# EAGLE schematic dw1000_schematic (EAGLE 9.6.2)
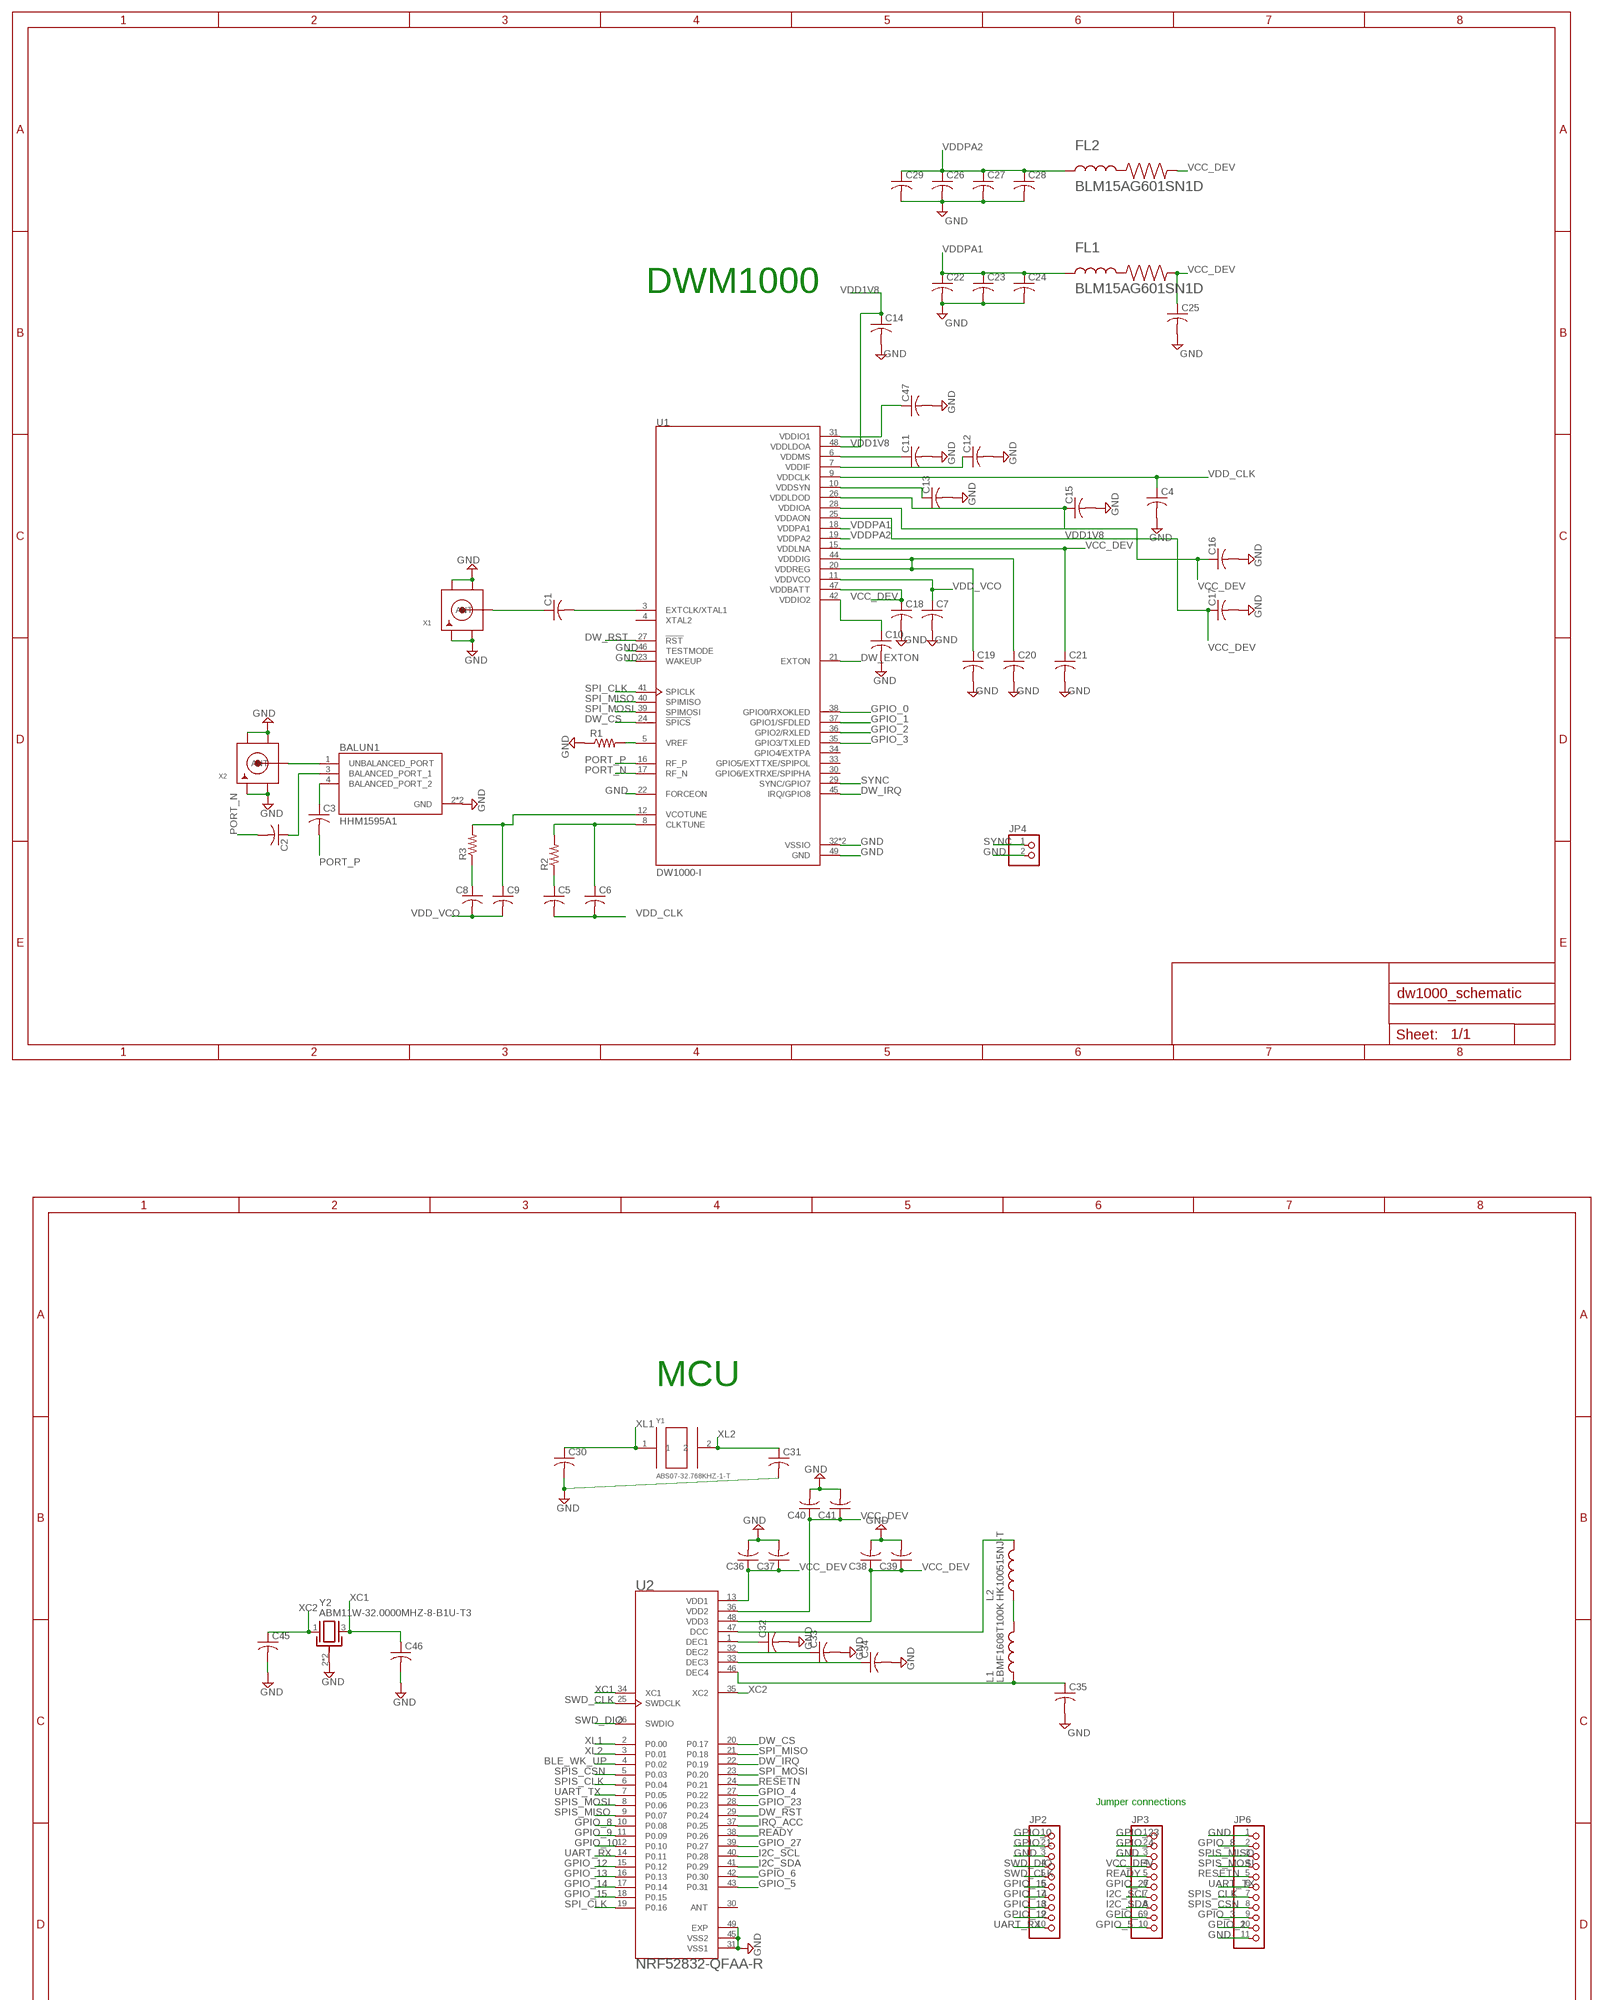
[diagram p0: schematic, sheet 1, part 1 of 2]
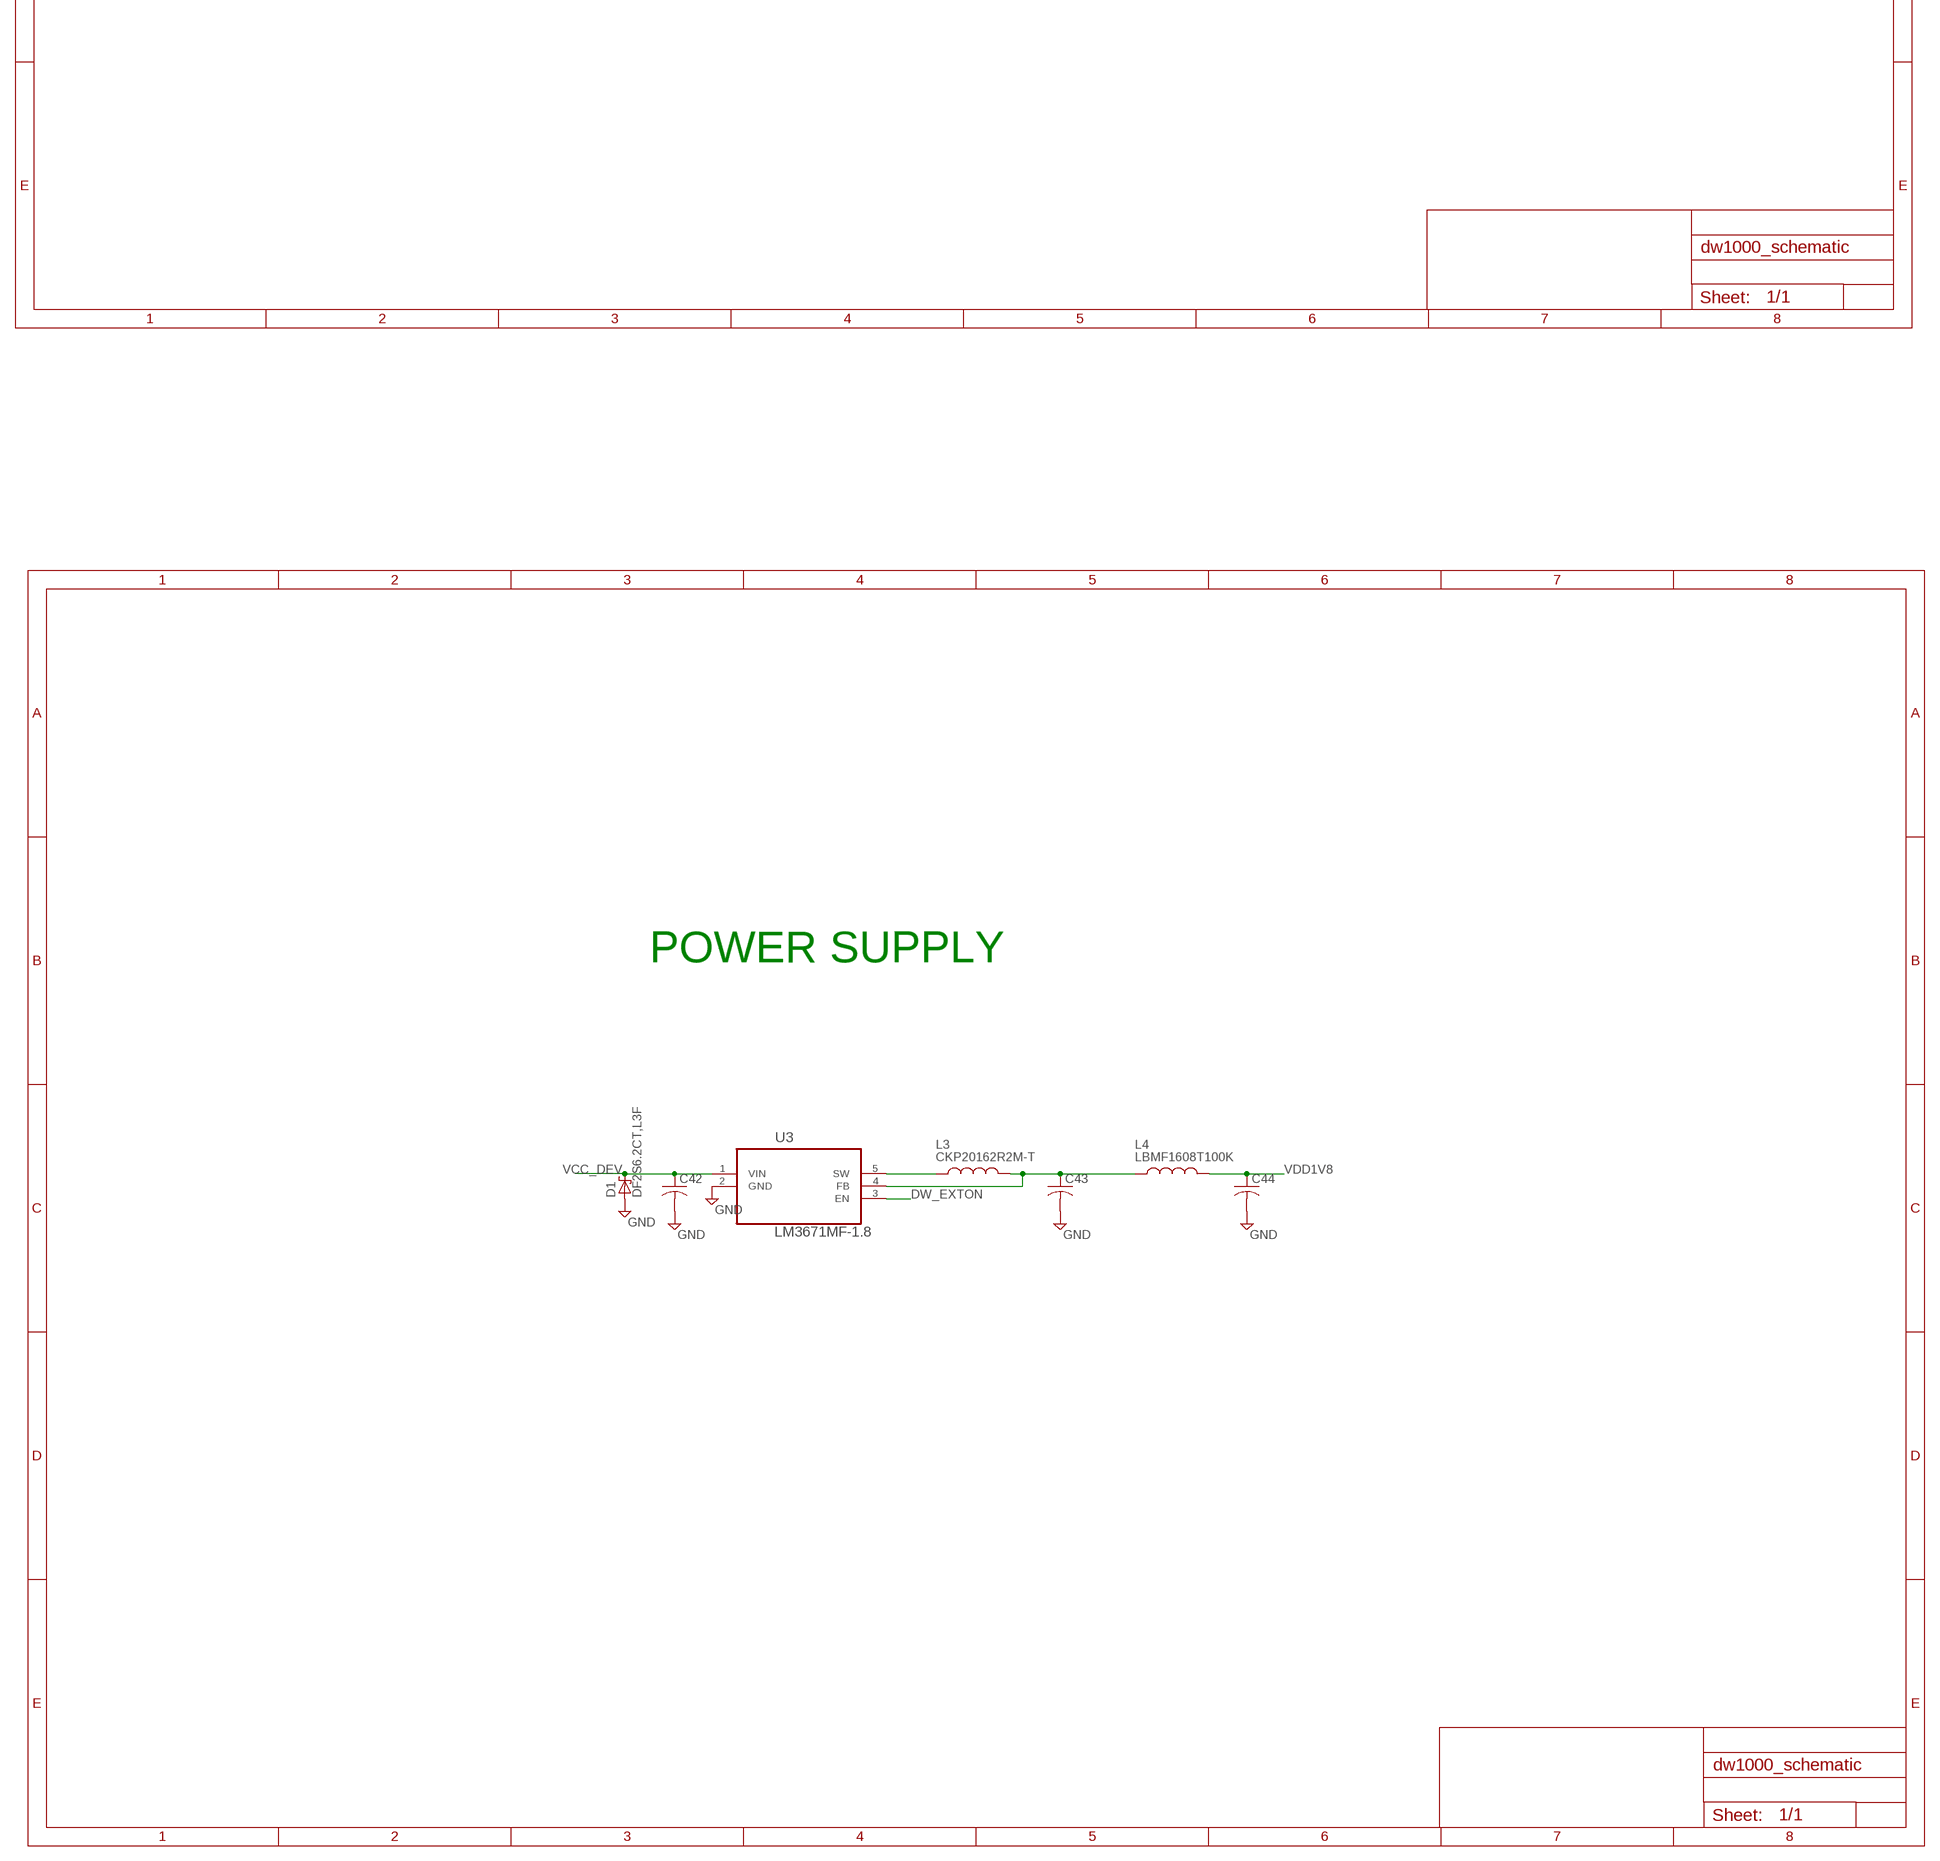
[diagram p1: schematic, sheet 1, part 2 of 2]

## Parts
BALUN1  HHM1595A1  [BALUN_HHM1595A1]
C1  C-USC0603K  [C0603K]
C2  C-USC0402K  [C0402K]
C3  C-USC0402K  [C0402K]
C4  C-USC0402K  [C0402K]
C5  C-USC0402K  [C0402K]
C6  C-USC0402K  [C0402K]
C7  C-USC0402K  [C0402K]
C8  C-USC0402K  [C0402K]
C9  C-USC0402K  [C0402K]
C10  C-USC0402K  [C0402K]
C11  C-USC0402K  [C0402K]
C12  C-USC0402K  [C0402K]
C13  C-USC0402K  [C0402K]
C14  C-USC0402K  [C0402K]
C15  C-USC0402K  [C0402K]
C16  C-USC0402K  [C0402K]
C17  C-USC0402K  [C0402K]
C18  C-USC0402K  [C0402K]
C19  C-USC0402K  [C0402K]
C20  C-USC0402K  [C0402K]
C21  C-USC0402K  [C0402K]
C22  C-USC0402K  [C0402K]
C23  C-USC0402K  [C0402K]
C24  C-USC0402K  [C0402K]
C25  C-USC0603K  [C0603K]
C26  C-USC0402K  [C0402K]
C27  C-USC0402K  [C0402K]
C28  C-USC0402K  [C0402K]
C29  C-USC0805K  [C0805K]
C30  C-USC0402K  [C0402K]
C31  C-USC0402K  [C0402K]
C32  C-USC0402K  [C0402K]
C33  C-USC0402K  [C0402K]
C34  C-USC0402K  [C0402K]
C35  C-USC0603K  [C0603K]
C36  C-USC0402K  [C0402K]
C37  C-USC0402K  [C0402K]
C38  C-USC0603K  [C0603K]
C39  C-USC0402K  [C0402K]
C40  C-USC0402K  [C0402K]
C41  C-USC0402K  [C0402K]
C42  C-USC0603K  [C0603K]
C43  C-USC0603K  [C0603K]
C44  C-USC0603K  [C0603K]
C45  C-USC0402K  [C0402K]
C46  C-USC0402K  [C0402K]
C47  C-USC0402K  [C0402K]
D1  DF2S6.2CT,L3F  [DF2S6.2CT,L3F]
FL1  BLM15AG601SN1D  [BEADC1005X55N]
FL2  BLM15AG601SN1D  [BEADC1005X55N]
JP2  PINHD-1X10  [1X10]
JP3  PINHD-1X10  [1X10]
JP4  PINHD-1X2  [1X02]
JP6  PINHD-1X11  [1X11]
L1  LBMF1608T100K  [INDC1608X100N]
L2  HK100515NJ-T  [INDC1005X55N]
L3  CKP20162R2M-T  [INDC2016X100N]
L4  LBMF1608T100K  [INDC1608X100N]
R1  R-US_R0402  [R0402]
R2  R-US_R0402  [R0402]
R3  R-US_R0402  [R0402]
U1  DW1000-I  [QFN40P600X600X90-49N]
U2  NRF52832-QFAA-R  [QFN40P600X600X90-49N]
U3  LM3671MF-1.8  [SOT95P284X122-5N]
X1  SMACONNECTOR_EDGE  [SMA_EDGELAUNCH]
X2  SMACONNECTOR_EDGE  [SMA_EDGELAUNCH]
Y1  ABS07-32.768KHZ-1-T  [XTAL320X150X90]
Y2  ABM11W-32.0000MHZ-8-B1U-T3  [XTAL_ABM11W-32.0000MHZ-8-B1U-T3]

## Nets
BLE_WK_UP: U2.4(P0.02)
DW_CS: U1.24(!SPICS) U2.20(P0.17)
DW_EXTON: U1.21(EXTON) U3.3(EN)
DW_IRQ: U1.45(IRQ/GPIO8) U2.22(P0.19)
DW_RST: U1.27(!RST) U2.29(P0.24)
GND: BALUN1.2(GND) BALUN1.5(GND) C4.2 C7.2 C10.2 C11.2 C12.2 C13.2 C14.2 C15.2 C16.2 C17.2 C18.2 C19.2 C20.2 C21.2 C22.2 C23.2 C24.2 C25.2 C26.2 C27.2 C28.2 C29.2 C30.2 C31.2 C32.2 C33.2 C34.2 C35.2 C36.2 C37.2 C38.2 C39.2 C40.2 C41.2 C42.2 C43.2 C44.2 C45.2 C46.2 C47.2 D1.1 JP2.3 JP3.3 JP4.2 JP6.1 JP6.11 R1.1 U1.22(FORCEON) U1.23(WAKEUP) U1.32(VSSIO) U1.43(VSSIO) U1.46(TESTMODE) U1.49(GND) U2.31(VSS1) U2.45(VSS2) U2.49(EXP) U3.2(GND) X1.GND@1(GND4) X1.GND@2(GND3) X1.GND@3(GND2) X1.GND@4(GND1) X2.GND@1(GND4) X2.GND@2(GND3) X2.GND@3(GND2) X2.GND@4(GND1) Y2.2(GND) Y2.4(GND)
GPIO_0: JP2.1 U1.38(GPIO0/RXOKLED)
GPIO_1: JP2.2 U1.37(GPIO1/SFDLED)
GPIO_2: JP6.10 U1.36(GPIO2/RXLED)
GPIO_3: JP6.9 U1.35(GPIO3/TXLED)
GPIO_4: JP3.2 U2.27(P0.22)
GPIO_5: JP3.10 U2.43(P0.31)
GPIO_6: JP3.9 U2.42(P0.30)
GPIO_8: JP6.2 U2.10(P0.08)
GPIO_9: U2.11(P0.09)
GPIO_10: U2.12(P0.10)
GPIO_12: JP2.9 U2.15(P0.12)
GPIO_13: JP2.8 U2.16(P0.13)
GPIO_14: JP2.7 U2.17(P0.14)
GPIO_15: JP2.6 U2.18(P0.15)
GPIO_23: JP3.1 U2.28(P0.23)
GPIO_27: JP3.6 U2.39(P0.27)
I2C_SCL: JP3.7 U2.40(P0.28)
I2C_SDA: JP3.8 U2.41(P0.29)
IRQ_ACC: U2.37(P0.25)
N$1: R1.2 U1.5(VREF)
N$2: BALUN1.1(UNBALANCED_PORT) X2.P(ANT)
N$3: C1.1 X1.P(ANT)
N$4: C1.2 U1.3(EXTCLK/XTAL1)
N$5: BALUN1.3(BALANCED_PORT_1) C2.1
N$6: BALUN1.4(BALANCED_PORT_2) C3.1
N$7: C5.1 R2.1
N$8: C6.1 R2.2 U1.8(CLKTUNE)
N$9: C9.1 R3.2 U1.12(VCOTUNE)
N$10: C47.1 U1.31(VDDIO1)
N$11: C8.1 R3.1
N$12: C11.1 U1.6(VDDMS)
N$13: C12.1 U1.7(VDDIF)
N$14: C13.1 U1.10(VDDSYN)
N$15: C19.1 C20.1 U1.20(VDDREG) U1.44(VDDDIG)
N$16: C10.1 U1.42(VDDIO2)
N$17: C32.1 U2.1(DEC1)
N$18: C33.1 U2.32(DEC2)
N$19: C34.1 U2.33(DEC3)
N$20: C35.1 L1.1 U2.46(DEC4)
N$21: L1.2 L2.1
N$22: L2.2 U2.47(DCC)
N$23: L3.1 U3.5(SW)
N$24: C43.1 L3.2 L4.1 U3.4(FB)
PORT_N [diff_pairs]: C2.2 U1.17(RF_N)
PORT_P [diff_pairs]: C3.2 U1.16(RF_P)
READY: JP3.5 U2.38(P0.26)
RESETN: JP6.5 U2.24(P0.21)
SPI_CLK: U1.41(SPICLK) U2.19(P0.16)
SPI_MISO: U1.40(SPIMISO) U2.21(P0.18)
SPI_MOSI: U1.39(SPIMOSI) U2.23(P0.20)
SPIS_CLK: JP6.7 U2.6(P0.04)
SPIS_CSN: JP6.8 U2.5(P0.03)
SPIS_MISO: JP6.3 U2.9(P0.07)
SPIS_MOSI: JP6.4 U2.8(P0.06)
SWD_CLK: JP2.5 U2.25(SWDCLK)
SWD_DIO: JP2.4 U2.26(SWDIO)
SYNC: JP4.1 U1.29(SYNC/GPIO7)
UART_RX: JP2.10 U2.14(P0.11)
UART_TX: JP6.6 U2.7(P0.05)
VCC_DEV: C16.1 C17.1 C18.1 C21.1 C25.1 C36.1 C37.1 C38.1 C39.1 C40.1 C41.1 C42.1 D1.2 FL1.2 FL2.2 JP3.4 U1.15(VDDLNA) U1.25(VDDAON) U1.28(VDDIOA) U1.47(VDDBATT) U2.13(VDD1) U2.36(VDD2) U2.48(VDD3) U3.1(VIN)
VDD1V8: C14.1 C15.1 C44.1 L4.2 U1.26(VDDLDOD) U1.48(VDDLDOA)
VDD_CLK: C4.1 C5.2 C6.2 U1.9(VDDCLK)
VDD_VCO: C7.1 C8.2 C9.2 U1.11(VDDVCO)
VDDPA1: C22.1 C23.1 C24.1 FL1.1 U1.18(VDDPA1)
VDDPA2: C26.1 C27.1 C28.1 C29.1 FL2.1 U1.19(VDDPA2)
XC1: C46.1 U2.34(XC1) Y2.3
XC2: C45.1 U2.35(XC2) Y2.1
XL1: C30.1 U2.2(P0.00) Y1.1
XL2: C31.1 U2.3(P0.01) Y1.2
Unconnected: U1.4(XTAL2) U1.30(GPIO6/EXTRXE/SPIPHA) U1.33(GPIO5/EXTTXE/SPIPOL) U1.34(GPIO4/EXTPA) U2.30(ANT)

## Notes on the sheet
- DWM1000
- MCU
- Jumper connections
- POWER SUPPLY

## Library data of the parts
BALUN1 = HHM1595A1:HHM1595A1: Baluns 50/100ohm, 3-8GHz Ultrawideband Balun; AVAILABILITY: Unavailable; DESCRIPTION: RF Balun 3GHz ~ 8GHz 50 / 100Ohm 0805 _2012 Metric_; DIGIKEY-PURCHASE-URL: https://snapeda.com/shop?store=DigiKey&id=490384; MF: TDK; MP: HHM1595A1; PACKAGE: 0805 TDK; PRICE: None
C1-C28 C30-C47 = adafruit:C-US: CAPACITOR, American symbol
C29 = rcl:C-US: CAPACITOR, American symbol; SPICEPREFIX: C
D1 = DF2S6.2CT:DF2S6.2CT,L3F
FL1 FL2 = BLM15AG601SN1D:BLM15AG601SN1D: Ferrite: bead; 600Ω; Mounting: SMD; 300mA; -55÷125°C; AVAILABILITY: Unavailable; DESCRIPTION: 600 Ohms @ 100MHz 1 Ferrite Bead 0402 _1005 Metric_ 300mA 520mOhm; MF: Murata; MP: BLM15AG601SN1D; PACKAGE: 1005 Taiyo Yuden; PRICE: None
JP2 JP3 = pinhead:PINHD-1X10: PIN HEADER
JP4 = pinhead:PINHD-1X2: PIN HEADER
JP6 = pinhead:PINHD-1X11: PIN HEADER
L1 L4 = LBMF1608T100K:LBMF1608T100K: Ind Chip Wirewound 10uH 10% 2.52MHz Ferrite 80mA 0603 T/R; AVAILABILITY: Unavailable; DESCRIPTION: 10µH Unshielded Wirewound Inductor 80mA 360mOhm 0603 _1608 Metric_; MF: Taiyo Yuden; MP: LBMF1608T100K; PACKAGE: 1608 Taiyo Yuden; PRICE: None
L2 = HK100515NJ-T:HK100515NJ-T: Ind High Frequency Chip Multi-Layer 15nH 5% 100MHz 8Q-Factor Ceramic 320mA 0402 T/R; AVAILABILITY: Unavailable; DESCRIPTION: 15nH Unshielded Multilayer Inductor 320mA 460mOhm Max 0402 _1005 Metric_; DIGIKEY-PURCHASE-URL: https://snapeda.com/shop?store=DigiKey&id=55773; MF: Taiyo Yuden; MP: HK100515NJ-T; PACKAGE: 1005 Taiyo Yuden; PRICE: None
L3 = CKP20162R2M-T:CKP20162R2M-T: Ind Power Chip Multi-Layer 2.2uH 20% 1MHz Ferrite 1.2A 0806 T/R; AVAILABILITY: Unavailable; DESCRIPTION: 2.2µH Unshielded Multilayer Inductor 1.2A 140mOhm Max 0806 _2016 Metric_; MF: Taiyo Yuden; MP: CKP20162R2M-T; PACKAGE: 2016 Taiyo Yuden; PRICE: None
R1-R3 = adafruit:R-US_: RESISTOR, American symbol
U1 = DW1000-I:DW1000-I: The DW1000 is a fully integrated single chip Ultra Wideband (UWB) low-power low-cost transceiver IC compliant to IEEE802.15.4-2011. It can be used in 2-way ranging or TDOA location systems to locate assets to a precision of 10 cm. It also supports data transfer at rates up to 6.8 Mbps; AVAILABILITY: Unavailable; DESCRIPTION: IC RF TxRx Only 802.15.4 IR-UWB 3.5GHz ~ 6.5GHz 48-VFQFN Exposed Pad; MF: Decawave Limited; MP: DW1000-I; PACKAGE: QFN-48 Decawave; PRICE: None
U2 = NRF52832-QFAA-R:NRF52832-QFAA-R: Bluetooth SMART SOC IoT 2000Mbps 48-Pin QFN EP T/R; AVAILABILITY: Unavailable; DESCRIPTION: IC RF TxRx + MCU Bluetooth, General ISM > 1GHz ANT, Bluetooth v5.0 2.4GHz 48-VFQFN Exposed Pad; DIGIKEY-PURCHASE-URL: https://snapeda.com/shop?store=DigiKey&id=279951; MF: Nordic; MP: NRF52832-QFAA-R; PACKAGE: VFQFN-48 Nordic; PRICE: None
U3 = LM3671MF-1.8:LM3671MF-1.8: IC BUCK SYNC 1.8V 0.6A; ARROW_ELECTRONICS-PURCHASE-URL: https://snapeda.com/shop?store=Arrow+Electronics&id=30333; AVAILABILITY: Unavailable; DESCRIPTION: Buck Switching Regulator IC Positive Fixed 1.8V 1 Output 600mA SC-74A, SOT-753; DIGIKEY-PURCHASE-URL: https://snapeda.com/shop?store=DigiKey&id=30333; MF: Texas Instruments; MP: LM3671MF-1.8/NOPB; PACKAGE: SOT-23 Texas Instruments; PRICE: None
X1 X2 = adafruit:SMACONNECTOR: SMA Connector 90° DIP SMA Connector, 50 Ohm (4UConnector: 07259)
Y1 = ABS07-32.768KHZ-1-T:ABS07-32.768KHZ-1-T: ABS07 Series 32.768 kHz ±20 ppm 12.5 pF -40 to +85 C SMT Low Profile Crystal; AVAILABILITY: Unavailable; DESCRIPTION: 32.768kHz ±10ppm Crystal 12.5pF 70 kOhms 2-SMD, No Lead; DIGIKEY-PURCHASE-URL: https://snapeda.com/shop?store=DigiKey&id=384551; MF: Abracon; MP: ABS07-32.768KHZ-1-T; PACKAGE: SMD-2 Abracon; PRICE: None
Y2 = ABM11W-32.0000MHZ-8-B1U-T3:ABM11W-32.0000MHZ-8-B1U-T3: Crystal 32.0000mhz 8pf Smd; AVAILABILITY: Unavailable; DESCRIPTION: 32MHz ±10ppm Crystal 8pF 80 Ohms 4-SMD, No Lead; DIGIKEY-PURCHASE-URL: https://snapeda.com/shop?store=DigiKey&id=2583411; MF: Abracon LLC; MP: ABM11W-32.0000MHZ-8-B1U-T3; PACKAGE: SMD-4 Abracon LLC; PRICE: None

## Net classes
1 diff_pairs: width 0.216 mm